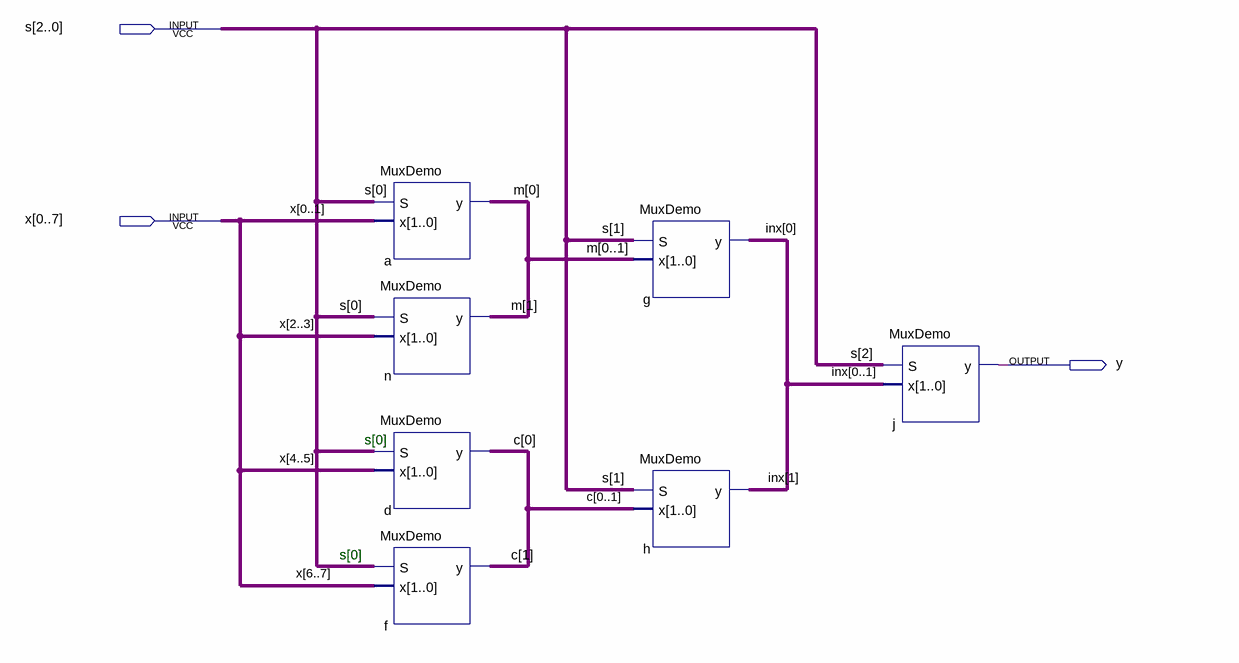
[diagram p0: schematic sheet]
// Quartus schematic Mux8_1.bdf as structural Verilog: 7 symbols, 3 pins
module Mux8_1 (
  input  [2:0] s,
  input  [0:7] x,
  output y
);

  wire [1:0] c, inx, m;

  MuxDemo a (.S(s[0]), .x(x[0:1]), .y(m[0]));
  MuxDemo n (.S(s[0]), .x(x[2:3]), .y(m[1]));
  MuxDemo d (.S(s[0]), .x(x[4:5]), .y(c[0]));
  MuxDemo f (.S(s[0]), .x(x[6:7]), .y(c[1]));
  MuxDemo g (.S(s[1]), .x({m[0], m[1]}), .y(inx[0]));
  MuxDemo h (.S(s[1]), .x({c[0], c[1]}), .y(inx[1]));
  MuxDemo j (.S(s[2]), .x({inx[0], inx[1]}), .y(y));

  // Notes on the sheet:
  //   s[0]
  //   s[0]
endmodule
